# EAGLE design hub (EAGLE 6.4)
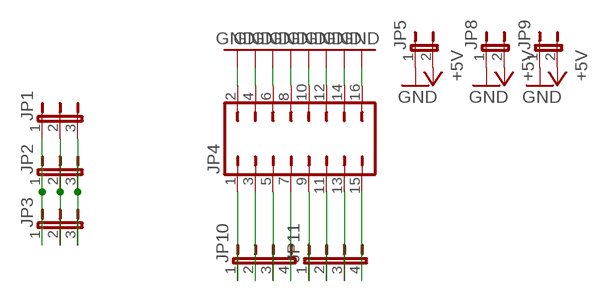
[diagram p0: schematic, sheet 1]

## Parts
JP1  JP2E  [JP2]
JP2  JP2E  [JP2]
JP3  JP2E  [JP2]
JP4  JP8Q  [JP8Q]
JP5  JP1E  [JP1]
JP8  JP1E  [JP1]
JP9  JP1E  [JP1]
JP10  JP4E  [JP4]
JP11  JP4E  [JP4]

## Nets
+5V: JP5.2 JP8.2 JP9.2
GND: JP4.2 JP4.4 JP4.6 JP4.8 JP4.10 JP4.12 JP4.14 JP4.16 JP5.1 JP8.1 JP9.1
N$1: JP1.1 JP2.1 JP3.1
N$2: JP1.2 JP2.2 JP3.2
N$3: JP1.3 JP2.3 JP3.3
N$4: JP4.1 JP10.1
N$5: JP4.3 JP10.2
N$6: JP4.5 JP10.3
N$7: JP4.7 JP10.4
N$8: JP4.9 JP11.1
N$9: JP4.11 JP11.2
N$10: JP4.13 JP11.3
N$11: JP4.15 JP11.4

## Library data of the parts
JP1-JP3 = jumper:JP2E: JUMPER
JP4 = jumper:JP8Q: JUMPER
JP5 JP8 JP9 = jumper:JP1E: JUMPER
JP10 JP11 = jumper:JP4E: JUMPER

## Board
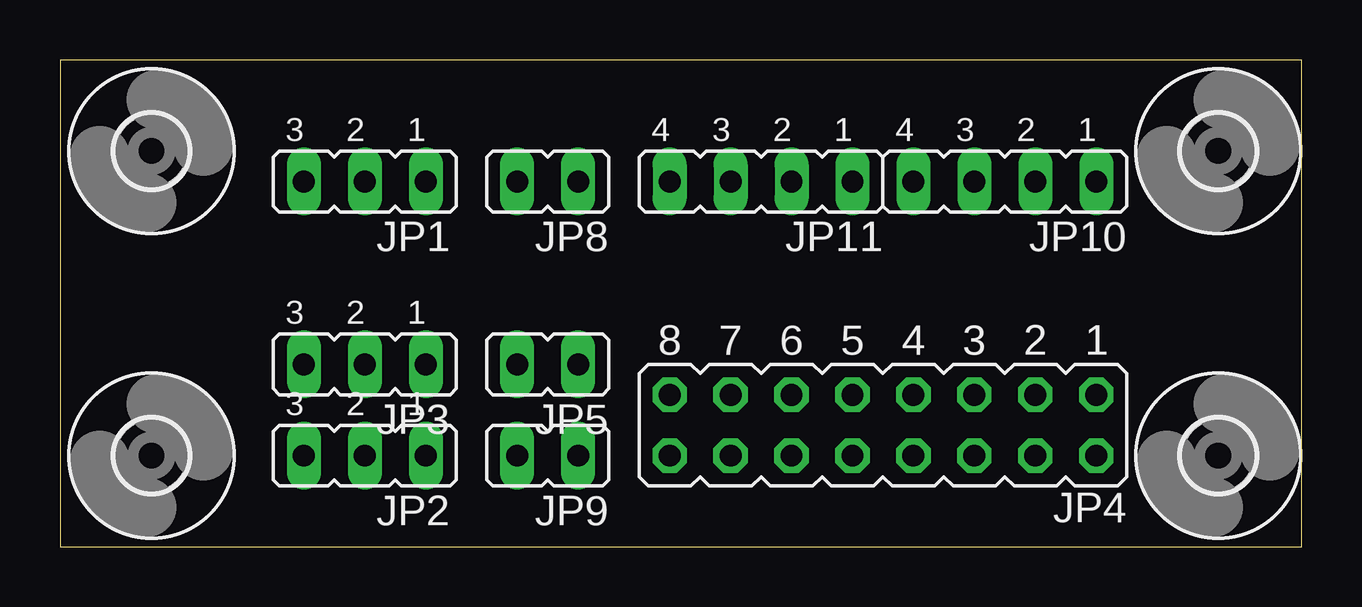
[diagram p1: board, top side]
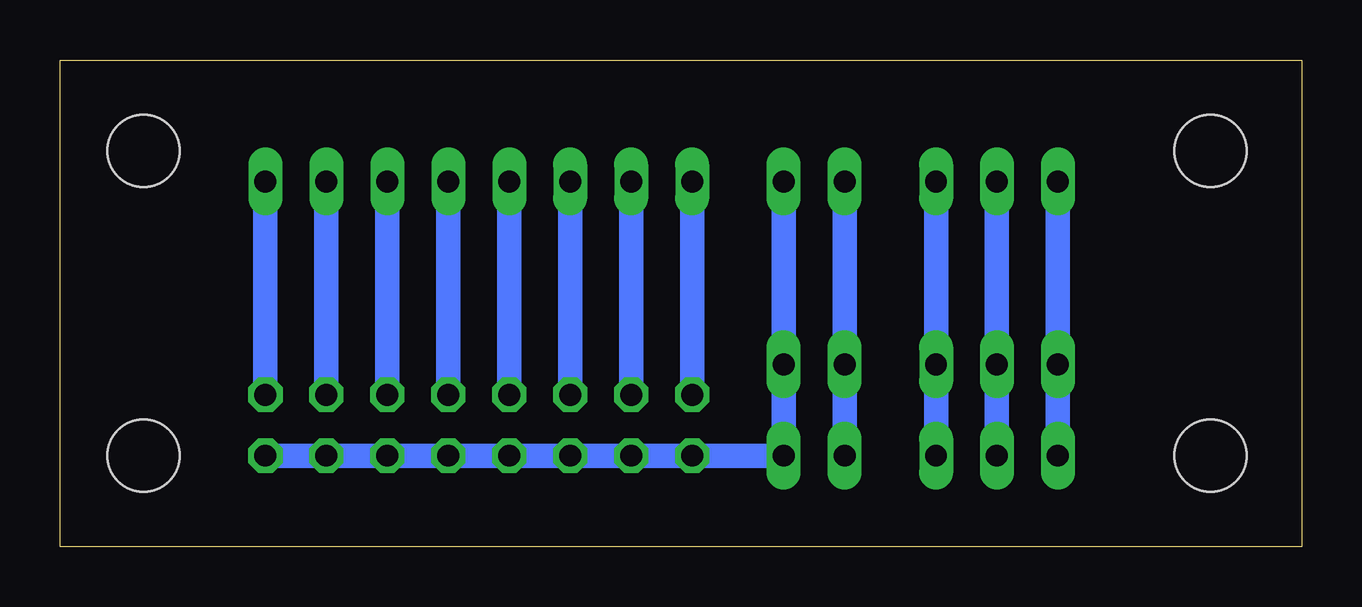
[diagram p2: board, bottom side, seen from below]

Size 51.74 x 20.31 mm. Coordinates in mm from the lower left corner, seen from the top.
Outline: 0,0 51.74,0 51.74,20.31 0,20.31 0,0
Copper layers (1*16): Top 0.035mm / dielectric 1.5mm / Bottom 0.035mm
Design rules "default": minimum track width 10mil, minimum drill 24mil, track to track 8mil, track to pad 8mil, pad to pad 8mil, via to via 8mil, smd to smd 8mil, copper to edge 40mil, drill to drill 8mil, minimum pad ring 10mil, minimum via ring 8mil, stop-mask expansion 4mil, vias tented up to drill 0mil, thermal gap 10mil

### Footprints (pad centres in the part's own frame; a part is rotated, then mirrored left to right if it is on the bottom)
JP2 = drill 0.914 long: 1 -2.54,0; 2 0,0; 3 2.54,0
JP8Q = drill 0.914 octagon: 1 -8.89,-1.27; 2 -8.89,1.27; 3 -6.35,-1.27; 4 -6.35,1.27; 5 -3.81,-1.27; 6 -3.81,1.27; 7 -1.27,-1.27; 8 -1.27,1.27; 9 1.27,-1.27; 10 1.27,1.27; 11 3.81,-1.27; 12 3.81,1.27; 13 6.35,-1.27; 14 6.35,1.27; 15 8.89,-1.27; 16 8.89,1.27
JP1 = drill 0.914 long: 1 0,-1.27; 2 0,1.27
JP4 = drill 0.914 long: 1 -3.81,0; 2 -1.27,0; 3 1.27,0; 4 3.81,0
3,0 = hole 3: 0,0

### Placement (x,y rotation side)
JP1  12.7,15.24 180 top
JP2  12.7,3.81 180 top
JP3  12.7,7.62 180 top
JP4  34.29,5.08 180 top
JP5  20.32,7.62 90 top
JP8  20.32,15.24 90 top
JP9  20.32,3.81 90 top
JP10  39.37,15.24 180 top
JP11  29.21,15.24 180 top
U$1  [3,0]  3.81,16.51 0 top
U$2  [3,0]  48.26,16.51 0 top
U$3  [3,0]  48.26,3.81 0 top
U$4  [3,0]  3.81,3.81 0 top

### Tracks (layer width: path | path; a pad name or v marks a point on that pad's centre or on a via)
+5V
  Bottom 1.016: JP8.2 JP5.2 JP9.2
GND
  Bottom 1.016: JP4.2 JP4.4 JP4.6 JP4.8 JP4.10 JP4.12 JP4.14 JP4.16 JP9.1 JP5.1 JP8.1
N$1
  Bottom 1.016: JP2.1 JP3.1 JP1.1
N$2
  Bottom 1.016: JP1.2 JP3.2 JP2.2
N$3
  Bottom 1.016: JP1.3 JP3.3 JP2.3
N$4
  Bottom 1.016: JP4.1 JP10.1
N$5
  Bottom 1.016: JP4.3 JP10.2
N$6
  Bottom 1.016: JP10.3 JP4.5
N$7
  Bottom 1.016: JP4.7 JP10.4
N$8
  Bottom 1.016: JP11.1 JP4.9
N$9
  Bottom 1.016: JP4.11 JP11.2
N$10
  Bottom 1.016: JP11.3 JP4.13
N$11
  Bottom 1.016: JP4.15 JP11.4